# Altium schematic sheet 51单片机.SchDoc
size A2
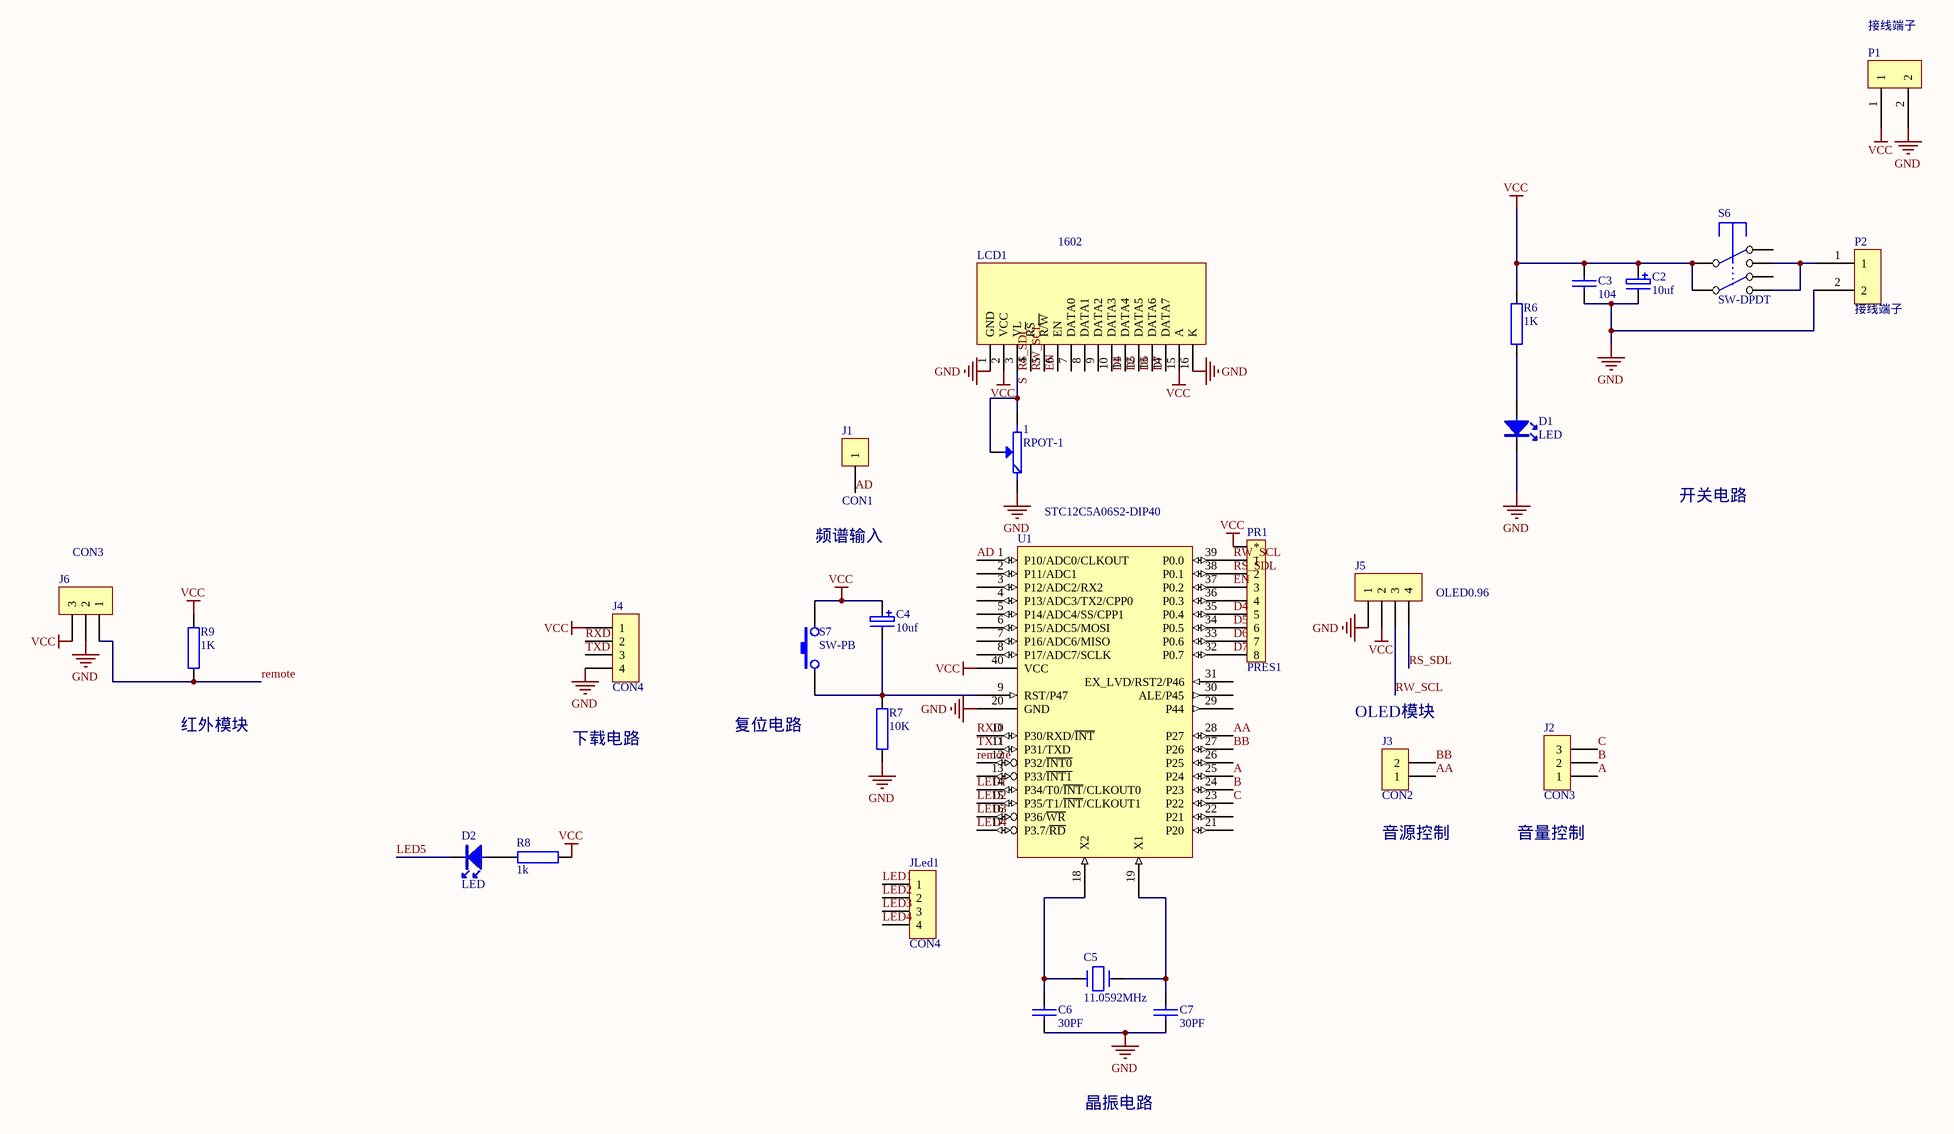
[diagram p0: 51单片机.SchDoc]

## Parts
1  RPOT-1  [RVR-2]
C2  10uf  [CAO2]
C3  104  [CAP2]
C4  10uf  [CAO2]
C5  11.0592MHz  [XTAL1]
C6  30PF  [CAP2]
C7  30PF  [CAP2]
D1  LED  [LED2_B]
D2  LED  [LED2_B]
J1  CON1  [SIP-1]
J2  CON3  [sip-3]
J3  CON2  [sip-2]
J4  CON4  [sip-4]
J5  OLED0.96  [sip-4]
J6  CON3  [sip-3]
JLed1  CON4  [sip-4]
LCD1  1602  [1602]
P1  接线端子  [接线端子]
P2  接线端子  [接线端子]
PR1  PRES1  [RP1]
R6  1K  [AXIAL0.4]
R7  10K  [AXIAL0.4]
R8  1k  [AXIAL0.4]
R9  1K  [AXIAL0.4]
S6  SW-DPDT  [SWH8*8]
S7  SW-PB  [SW6*6]
U1  STC12C5A06S2-DIP40  [DIP-40]

## Nets
GND: 1.1 C2.2 C3.2 C6.2 C7.2 D1.2 J4.4 J5.1 J6.2 LCD1.1(GND) LCD1.16(K) P1.2 P2.2 R7.1 U1.20(GND)
VCC: C2.1 C3.1 C4.1 J4.1 J5.2 J6.3 LCD1.2(VCC) LCD1.15(A) P1.1 PR1.1 R6.2 R8.1 R9.2 S6.2 S6.5 S7.2 U1.40(VCC)
A: J2.1 U1.25(P24)
AA: J3.1 U1.28(P27)
AD: J1.1 U1.1(P10/ADC0/CLKOUT)
B: J2.2 U1.24(P23)
BB: J3.2 U1.27(P26)
C: J2.3 U1.23(P22)
D4: LCD1.11(DATA4) PR1.6(5) U1.35(P0.4)
D5: LCD1.12(DATA5) PR1.7(6) U1.34(P0.5)
D6: LCD1.13(DATA6) PR1.8(7) U1.33(P0.6)
D7: LCD1.14(DATA7) PR1.9(8) U1.32(P0.7)
EN: LCD1.6(EN) PR1.4(3) U1.37(P0.2)
LED1: JLed1.1 U1.14(P34/T0/~{INT}/CLKOUT0)
LED2: JLed1.2 U1.15(P35/T1/~{INT}/CLKOUT1)
LED3: JLed1.3 U1.16(P36/~{WR})
LED4: JLed1.4 U1.17(P3.7/~{RD})
LED5: D2.2
remote: J6.1 R9.1 U1.12(P32/~{INT0})
RS_SDL: J5.4 LCD1.4(R~{S}) PR1.3(2) U1.38(P0.1)
RW_SCL: J5.3 LCD1.5(R/~{W}) PR1.2(1) U1.39(P0.0)
RXD: J4.2 U1.10(P30/RXD/~{INT})
TXD: J4.3 U1.11(P31/TXD)
Net1_2: 1.2(M) 1.3 LCD1.3(VL)
NetC4_2: C4.2 R7.2 S7.1 U1.9(RST/P47)
NetC5_1: C5.1 C6.1 U1.18(X2)
NetC5_2: C5.2 C7.1 U1.19(X1)
NetD1_1: D1.1 R6.1
NetD2_1: D2.1 R8.2
NetP2_1: P2.1 S6.3 S6.4
NetPR1_5: PR1.5(4) U1.36(P0.3)

Not connected (* = marked no-connect by the designer): LCD1 7(DATA0) 8(DATA1) 9(DATA2) 10(DATA3); S6 1 6; U1 2(P11/ADC1) 3(P12/ADC2/RX2) 4(P13/ADC3/TX2/CPP0) 5(P14/ADC4/SS/CPP1) 6(P15/ADC5/MOSI) 7(P16/ADC6/MISO) 8(P17/ADC7/SCLK) 13(P33/~{INT1}) 21(P20) 22(P21) 26(P25) 29(P44) 30(ALE/P45) 31(EX_LVD/RST2/P46)

## Notes on the sheet
- 频谱输入
- 开关电路
- (near R9) 红外模块
- 下载电路
- 复位电路
- (near J3) OLED模块
- (near J3) 音源控制
- (near J2) 音量控制
- 晶振电路
- Labels drawn without touching a wire or pin: S

## Library data of the parts
1 = RPOT-1: 普通电位器
C2 C4 = CAP3
C3 C6 C7 = CAP1
C5 = CPY
J1 = CON1: Connector
J2 J6 = CON3: Connector
J3 = CON2: Connector
J4 J5 JLed1 = CON4: Connector
R6-R9 = RES: 电阻